# Altium project PLC.PrjPcb
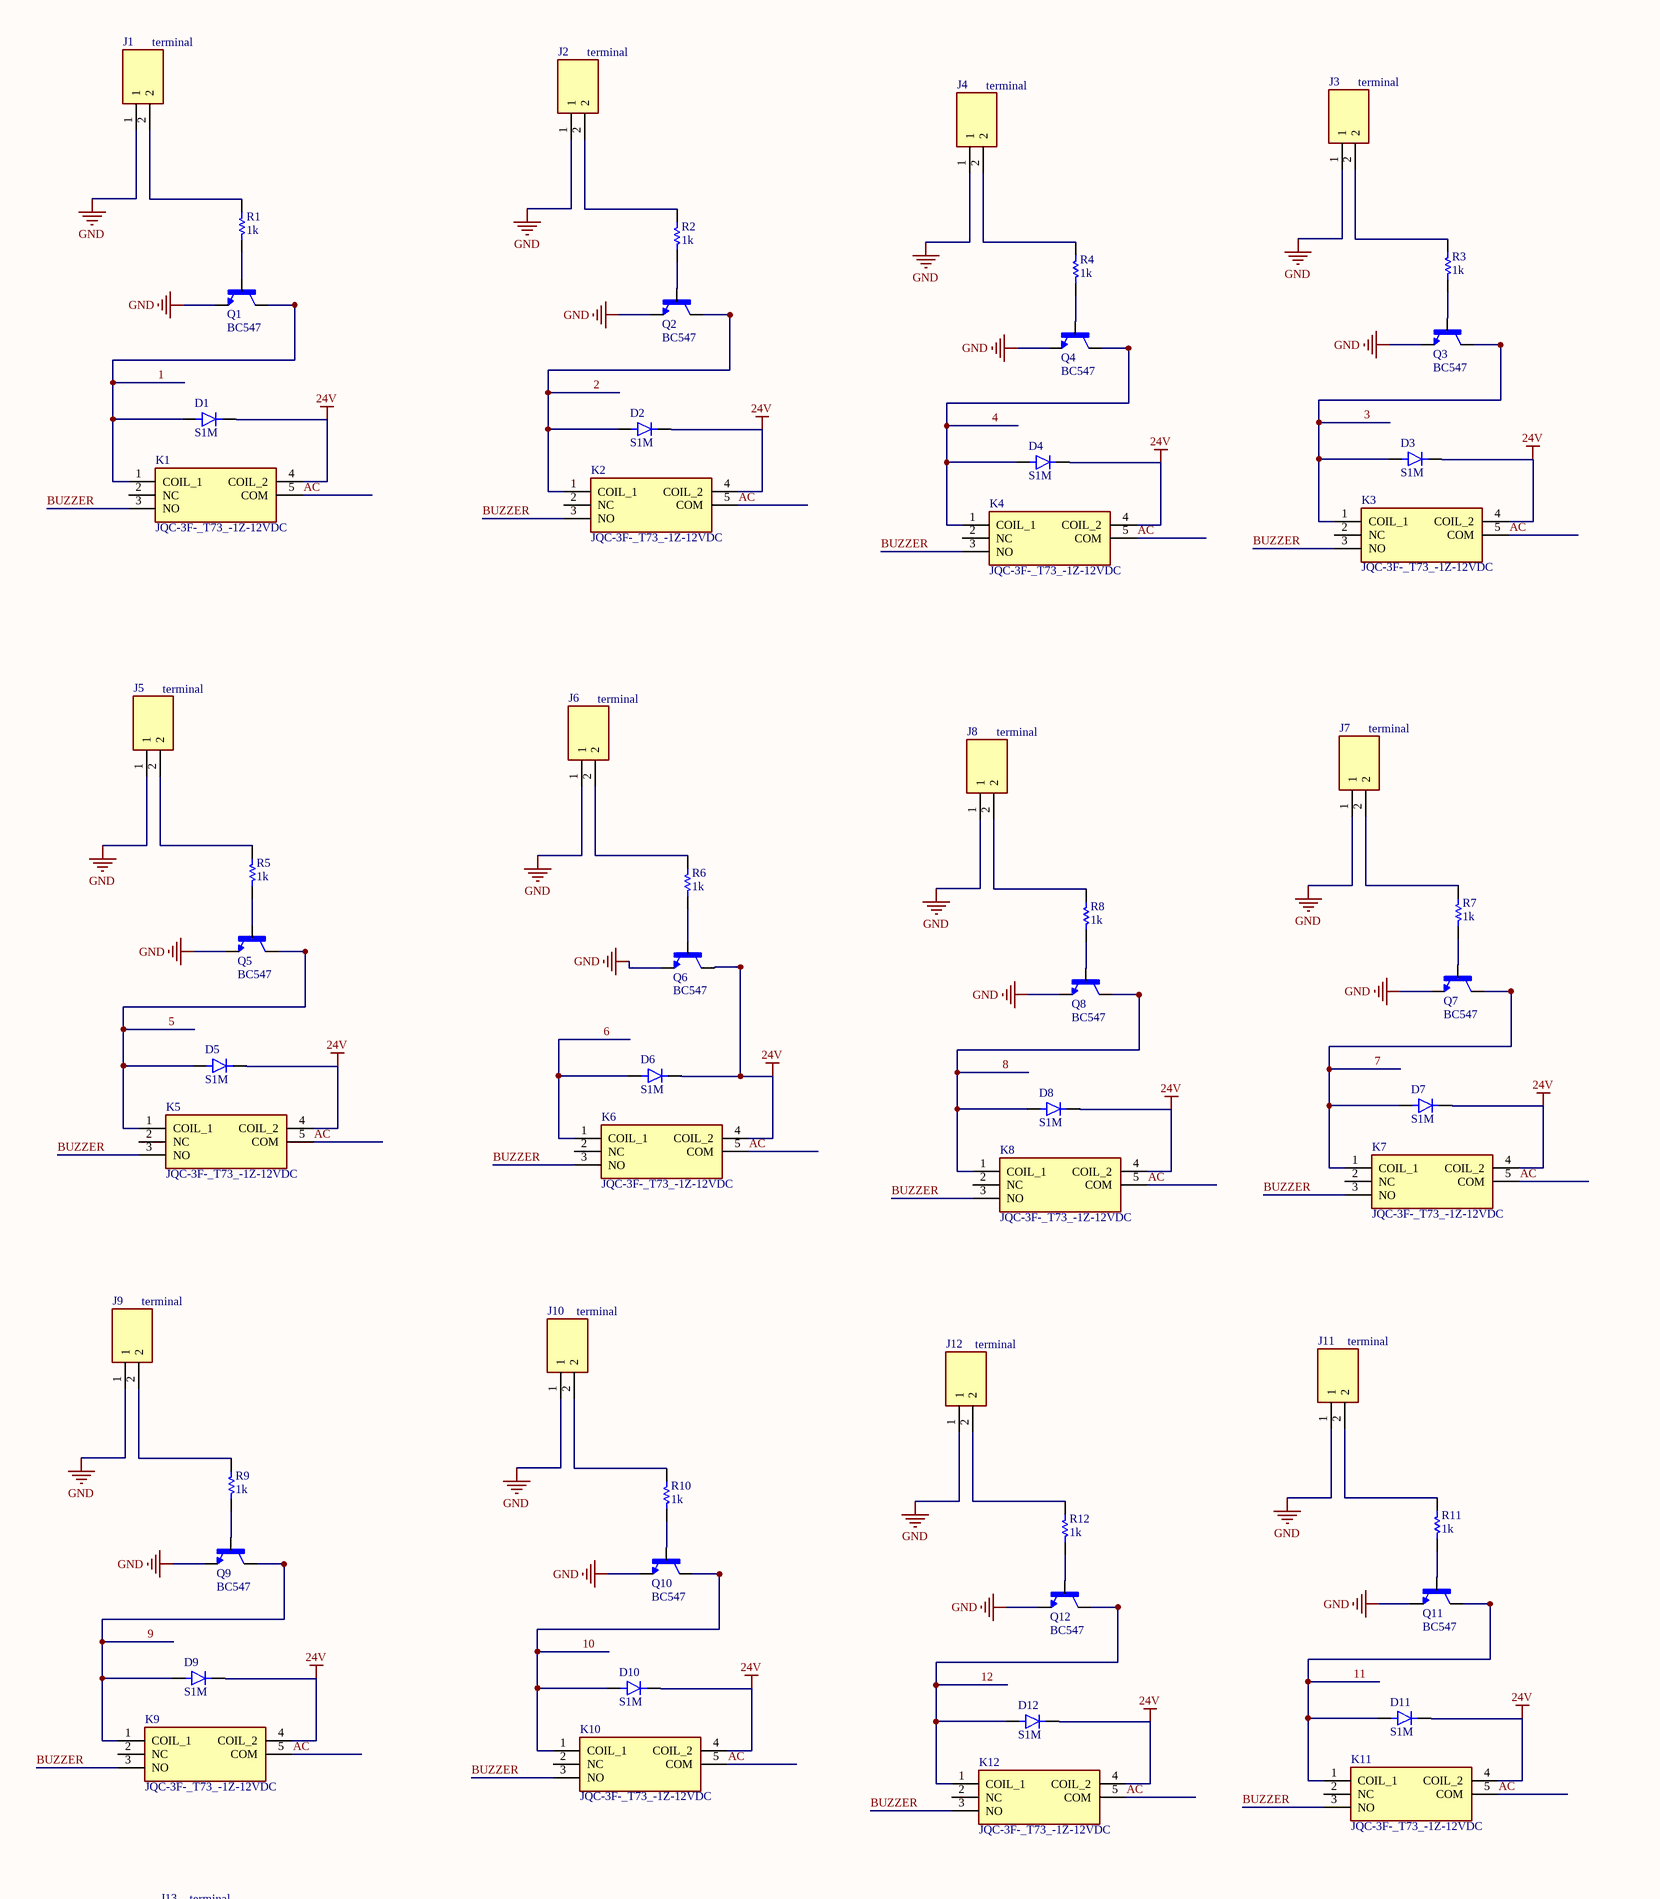
[diagram p0: Sheet1.SchDoc, top]
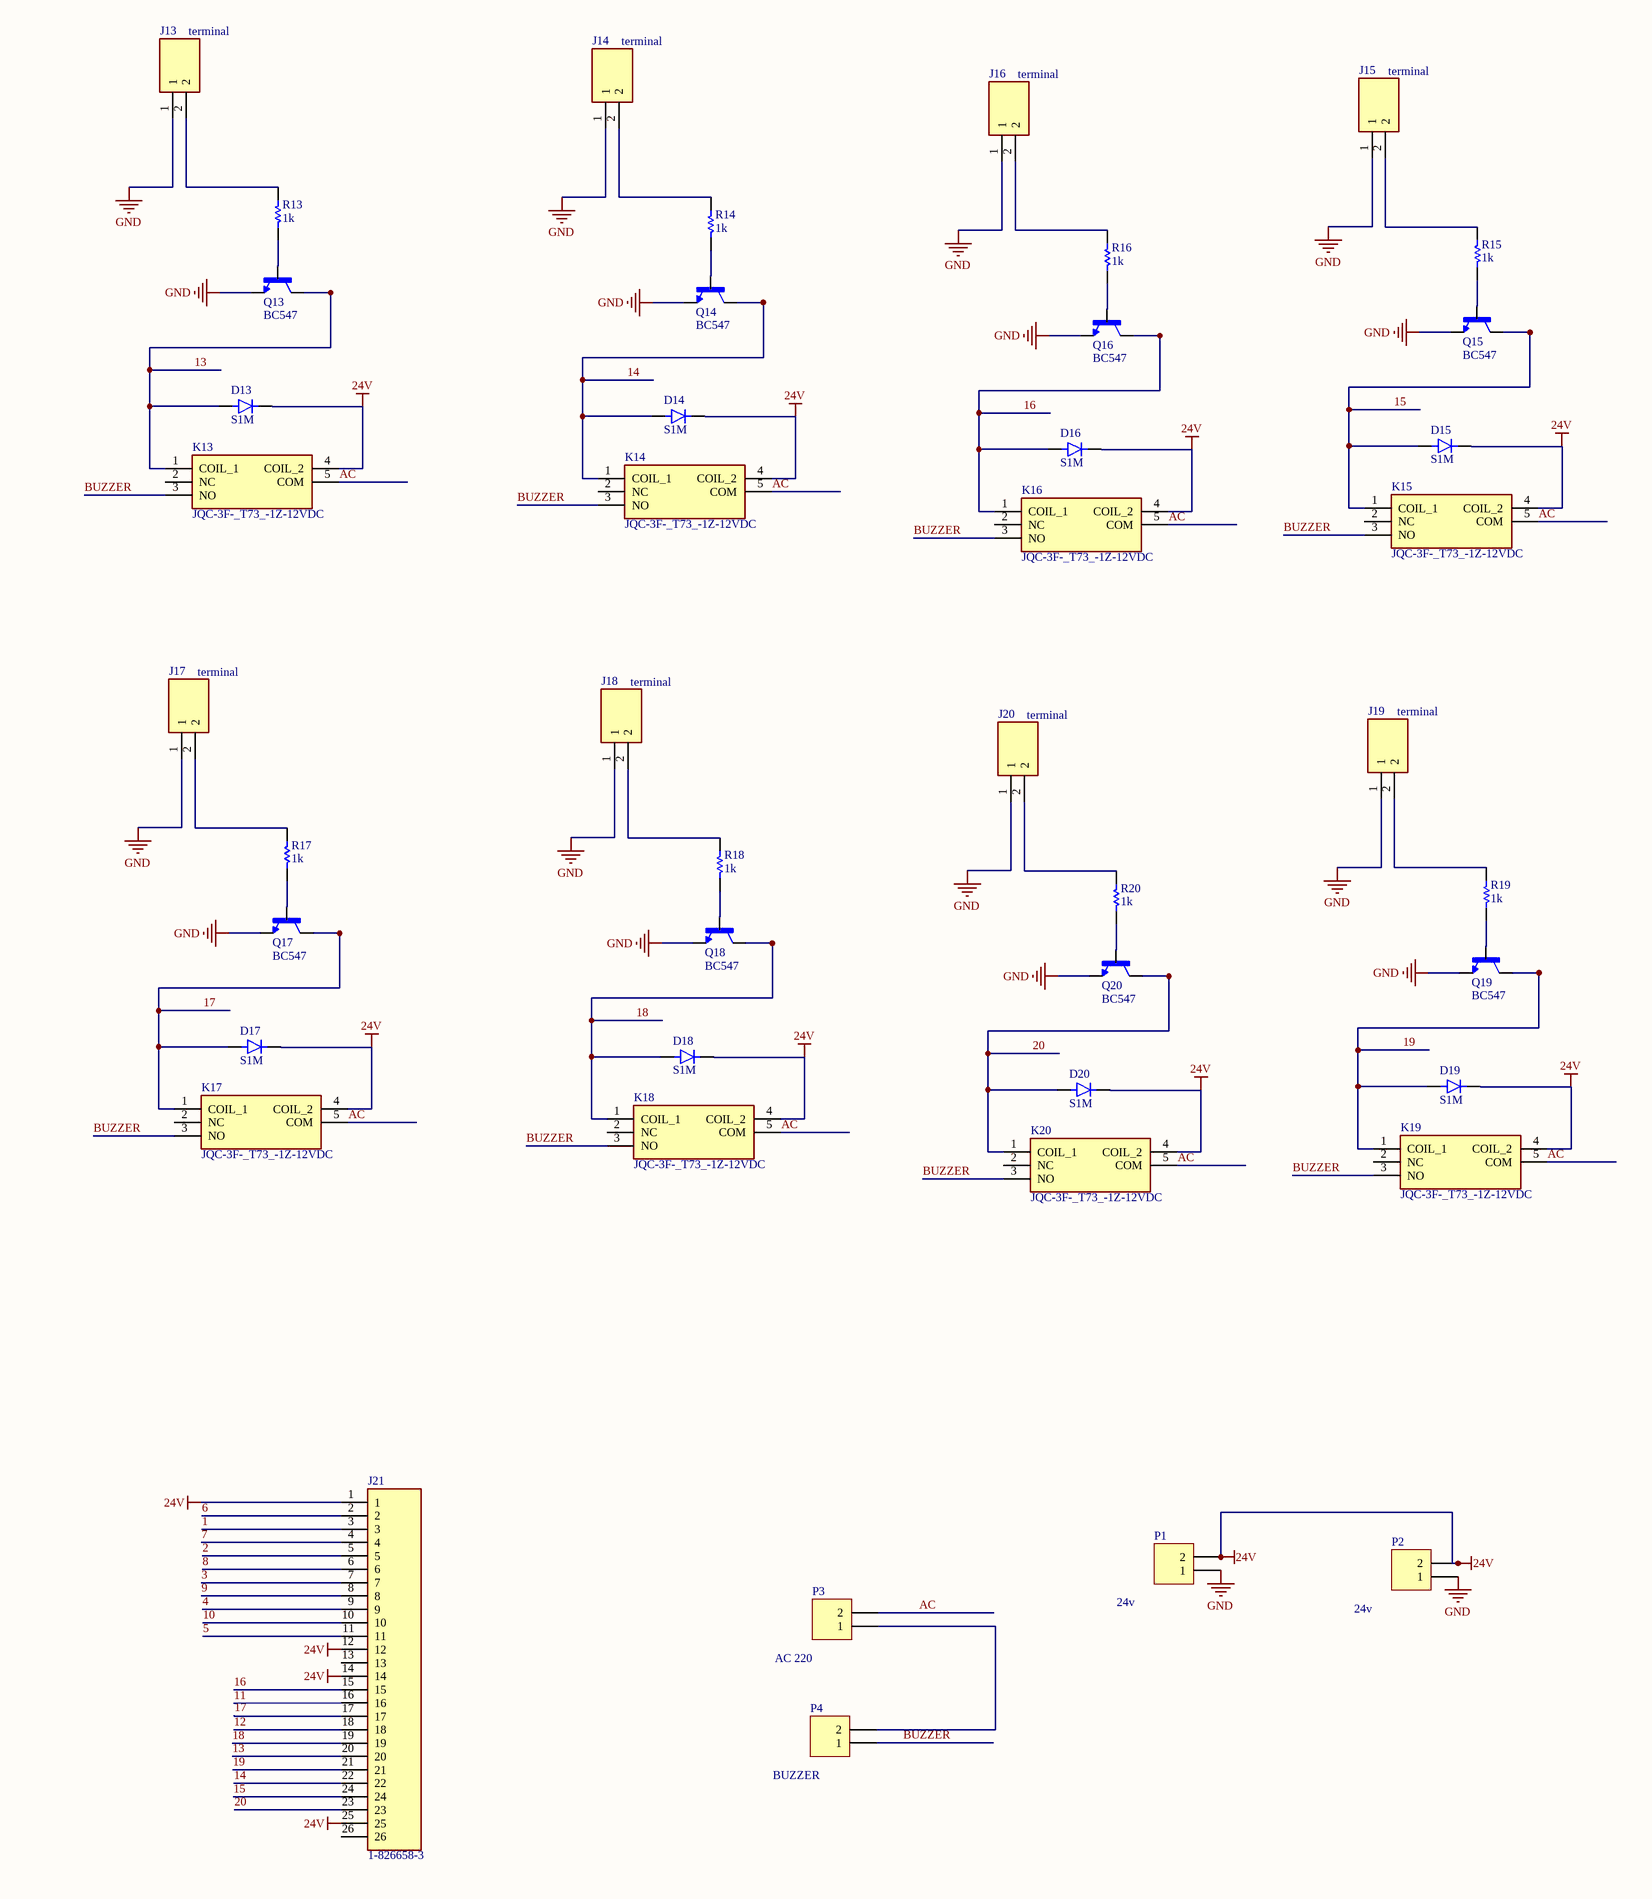
[diagram p1: Sheet1.SchDoc, bottom]
1 sheet, 105 parts. Net scope: global (net labels, ports and power ports of the same name join across sheets).
Board files: PCB1.PcbDoc, PCB2.PcbDoc

## Sheet Sheet1.SchDoc
size A0; SheetNumber: 1; SheetTotal: 2

### Parts
D1  S1M  [DIOM5227X270N]
D2  S1M  [DIOM5227X270N]
D3  S1M  [DIOM5227X270N]
D4  S1M  [DIOM5227X270N]
D5  S1M  [DIOM5227X270N]
D6  S1M  [DIOM5227X270N]
D7  S1M  [DIOM5227X270N]
D8  S1M  [DIOM5227X270N]
D9  S1M  [DIOM5227X270N]
D10  S1M  [DIOM5227X270N]
D11  S1M  [DIOM5227X270N]
D12  S1M  [DIOM5227X270N]
D13  S1M  [DIOM5227X270N]
D14  S1M  [DIOM5227X270N]
D15  S1M  [DIOM5227X270N]
D16  S1M  [DIOM5227X270N]
D17  S1M  [DIOM5227X270N]
D18  S1M  [DIOM5227X270N]
D19  S1M  [DIOM5227X270N]
D20  S1M  [DIOM5227X270N]
J1  terminal  [PHOENIX_1935161]
J2  terminal  [PHOENIX_1935161]
J3  terminal  [PHOENIX_1935161]
J4  terminal  [PHOENIX_1935161]
J5  terminal  [PHOENIX_1935161]
J6  terminal  [PHOENIX_1935161]
J7  terminal  [PHOENIX_1935161]
J8  terminal  [PHOENIX_1935161]
J9  terminal  [PHOENIX_1935161]
J10  terminal  [PHOENIX_1935161]
J11  terminal  [PHOENIX_1935161]
J12  terminal  [PHOENIX_1935161]
J13  terminal  [PHOENIX_1935161]
J14  terminal  [PHOENIX_1935161]
J15  terminal  [PHOENIX_1935161]
J16  terminal  [PHOENIX_1935161]
J17  terminal  [PHOENIX_1935161]
J18  terminal  [PHOENIX_1935161]
J19  terminal  [PHOENIX_1935161]
J20  terminal  [PHOENIX_1935161]
J21  1-826658-3  [TE_1-826658-3]
K1  JQC-3F-_T73_-1Z-12VDC  [JQC3FT731Z12VDC]
K2  JQC-3F-_T73_-1Z-12VDC  [JQC3FT731Z12VDC]
K3  JQC-3F-_T73_-1Z-12VDC  [JQC3FT731Z12VDC]
K4  JQC-3F-_T73_-1Z-12VDC  [JQC3FT731Z12VDC]
K5  JQC-3F-_T73_-1Z-12VDC  [JQC3FT731Z12VDC]
K6  JQC-3F-_T73_-1Z-12VDC  [JQC3FT731Z12VDC]
K7  JQC-3F-_T73_-1Z-12VDC  [JQC3FT731Z12VDC]
K8  JQC-3F-_T73_-1Z-12VDC  [JQC3FT731Z12VDC]
K9  JQC-3F-_T73_-1Z-12VDC  [JQC3FT731Z12VDC]
K10  JQC-3F-_T73_-1Z-12VDC  [JQC3FT731Z12VDC]
K11  JQC-3F-_T73_-1Z-12VDC  [JQC3FT731Z12VDC]
K12  JQC-3F-_T73_-1Z-12VDC  [JQC3FT731Z12VDC]
K13  JQC-3F-_T73_-1Z-12VDC  [JQC3FT731Z12VDC]
K14  JQC-3F-_T73_-1Z-12VDC  [JQC3FT731Z12VDC]
K15  JQC-3F-_T73_-1Z-12VDC  [JQC3FT731Z12VDC]
K16  JQC-3F-_T73_-1Z-12VDC  [JQC3FT731Z12VDC]
K17  JQC-3F-_T73_-1Z-12VDC  [JQC3FT731Z12VDC]
K18  JQC-3F-_T73_-1Z-12VDC  [JQC3FT731Z12VDC]
K19  JQC-3F-_T73_-1Z-12VDC  [JQC3FT731Z12VDC]
K20  JQC-3F-_T73_-1Z-12VDC  [JQC3FT731Z12VDC]
P1  24v  [HDR1X2_SMD - THD]
P2  24v  [HDR1X2_SMD - THD]
P3  AC 220  [HDR1X2_SMD - THD]
P4  BUZZER  [HDR1X2_SMD - THD]
Q1  BC547  [TO92]
Q2  BC547  [TO92]
Q3  BC547  [TO92]
Q4  BC547  [TO92]
Q5  BC547  [TO92]
Q6  BC547  [TO92]
Q7  BC547  [TO92]
Q8  BC547  [TO92]
Q9  BC547  [TO92]
Q10  BC547  [TO92]
Q11  BC547  [TO92]
Q12  BC547  [TO92]
Q13  BC547  [TO92]
Q14  BC547  [TO92]
Q15  BC547  [TO92]
Q16  BC547  [TO92]
Q17  BC547  [TO92]
Q18  BC547  [TO92]
Q19  BC547  [TO92]
Q20  BC547  [TO92]
R1  1k  [0805 - CAP - duplicate]
R2  1k  [0805 - CAP - duplicate]
R3  1k  [0805 - CAP - duplicate]
R4  1k  [0805 - CAP - duplicate]
R5  1k  [0805 - CAP - duplicate]
R6  1k  [0805 - CAP - duplicate]
R7  1k  [0805 - CAP - duplicate]
R8  1k  [0805 - CAP - duplicate]
R9  1k  [0805 - CAP - duplicate]
R10  1k  [0805 - CAP - duplicate]
R11  1k  [0805 - CAP - duplicate]
R12  1k  [0805 - CAP - duplicate]
R13  1k  [0805 - CAP - duplicate]
R14  1k  [0805 - CAP - duplicate]
R15  1k  [0805 - CAP - duplicate]
R16  1k  [0805 - CAP - duplicate]
R17  1k  [0805 - CAP - duplicate]
R18  1k  [0805 - CAP - duplicate]
R19  1k  [0805 - CAP - duplicate]
R20  1k  [0805 - CAP - duplicate]

### Nets
24V: D1.C(K) D2.C(K) D3.C(K) D4.C(K) D5.C(K) D6.C(K) D7.C(K) D8.C(K) D9.C(K) D10.C(K) D11.C(K) D12.C(K) D13.C(K) D14.C(K) D15.C(K) D16.C(K) D17.C(K) D18.C(K) D19.C(K) D20.C(K) J21.1 J21.12 J21.14 J21.25 K1.4(COIL_2) K2.4(COIL_2) K3.4(COIL_2) K4.4(COIL_2) K5.4(COIL_2) K6.4(COIL_2) K7.4(COIL_2) K8.4(COIL_2) K9.4(COIL_2) K10.4(COIL_2) K11.4(COIL_2) K12.4(COIL_2) K13.4(COIL_2) K14.4(COIL_2) K15.4(COIL_2) K16.4(COIL_2) K17.4(COIL_2) K18.4(COIL_2) K19.4(COIL_2) K20.4(COIL_2) P1.2 P2.2 Q6.1(C)
GND: J1.1 J2.1 J3.1 J4.1 J5.1 J6.1 J7.1 J8.1 J9.1 J10.1 J11.1 J12.1 J13.1 J14.1 J15.1 J16.1 J17.1 J18.1 J19.1 J20.1 P1.1 P2.1 Q1.3(E) Q2.3(E) Q3.3(E) Q4.3(E) Q5.3(E) Q6.3(E) Q7.3(E) Q8.3(E) Q9.3(E) Q10.3(E) Q11.3(E) Q12.3(E) Q13.3(E) Q14.3(E) Q15.3(E) Q16.3(E) Q17.3(E) Q18.3(E) Q19.3(E) Q20.3(E)
1: D1.A J21.3 K1.1(COIL_1) Q1.1(C)
2: D2.A J21.5 K2.1(COIL_1) Q2.1(C)
3: D3.A J21.7 K3.1(COIL_1) Q3.1(C)
4: D4.A J21.9 K4.1(COIL_1) Q4.1(C)
5: D5.A J21.11 K5.1(COIL_1) Q5.1(C)
6: D6.A J21.2 K6.1(COIL_1)
7: D7.A J21.4 K7.1(COIL_1) Q7.1(C)
8: D8.A J21.6 K8.1(COIL_1) Q8.1(C)
9: D9.A J21.8 K9.1(COIL_1) Q9.1(C)
10: D10.A J21.10 K10.1(COIL_1) Q10.1(C)
11: D11.A J21.16 K11.1(COIL_1) Q11.1(C)
12: D12.A J21.18 K12.1(COIL_1) Q12.1(C)
13: D13.A J21.20 K13.1(COIL_1) Q13.1(C)
14: D14.A J21.22 K14.1(COIL_1) Q14.1(C)
15: D15.A J21.24 K15.1(COIL_1) Q15.1(C)
16: D16.A J21.15 K16.1(COIL_1) Q16.1(C)
17: D17.A J21.17 K17.1(COIL_1) Q17.1(C)
18: D18.A J21.19 K18.1(COIL_1) Q18.1(C)
19: D19.A J21.21 K19.1(COIL_1) Q19.1(C)
20: D20.A J21.23 K20.1(COIL_1) Q20.1(C)
AC: K1.5(COM) K2.5(COM) K3.5(COM) K4.5(COM) K5.5(COM) K6.5(COM) K7.5(COM) K8.5(COM) K9.5(COM) K10.5(COM) K11.5(COM) K12.5(COM) K13.5(COM) K14.5(COM) K15.5(COM) K16.5(COM) K17.5(COM) K18.5(COM) K19.5(COM) K20.5(COM) P3.2
BUZZER: K1.3(NO) K2.3(NO) K3.3(NO) K4.3(NO) K5.3(NO) K6.3(NO) K7.3(NO) K8.3(NO) K9.3(NO) K10.3(NO) K11.3(NO) K12.3(NO) K13.3(NO) K14.3(NO) K15.3(NO) K16.3(NO) K17.3(NO) K18.3(NO) K19.3(NO) K20.3(NO) P4.1
NetJ1_2: J1.2 R1.2
NetJ2_2: J2.2 R2.2
NetJ3_2: J3.2 R3.2
NetJ4_2: J4.2 R4.2
NetJ5_2: J5.2 R5.2
NetJ6_2: J6.2 R6.2
NetJ7_2: J7.2 R7.2
NetJ8_2: J8.2 R8.2
NetJ9_2: J9.2 R9.2
NetJ10_2: J10.2 R10.2
NetJ11_2: J11.2 R11.2
NetJ12_2: J12.2 R12.2
NetJ13_2: J13.2 R13.2
NetJ14_2: J14.2 R14.2
NetJ15_2: J15.2 R15.2
NetJ16_2: J16.2 R16.2
NetJ17_2: J17.2 R17.2
NetJ18_2: J18.2 R18.2
NetJ19_2: J19.2 R19.2
NetJ20_2: J20.2 R20.2
NetP3_1: P3.1 P4.2
NetQ1_2: Q1.2(B) R1.1
NetQ2_2: Q2.2(B) R2.1
NetQ3_2: Q3.2(B) R3.1
NetQ4_2: Q4.2(B) R4.1
NetQ5_2: Q5.2(B) R5.1
NetQ6_2: Q6.2(B) R6.1
NetQ7_2: Q7.2(B) R7.1
NetQ8_2: Q8.2(B) R8.1
NetQ9_2: Q9.2(B) R9.1
NetQ10_2: Q10.2(B) R10.1
NetQ11_2: Q11.2(B) R11.1
NetQ12_2: Q12.2(B) R12.1
NetQ13_2: Q13.2(B) R13.1
NetQ14_2: Q14.2(B) R14.1
NetQ15_2: Q15.2(B) R15.1
NetQ16_2: Q16.2(B) R16.1
NetQ17_2: Q17.2(B) R17.1
NetQ18_2: Q18.2(B) R18.1
NetQ19_2: Q19.2(B) R19.1
NetQ20_2: Q20.2(B) R20.1

Not connected (* = marked no-connect by the designer): J21 13 26; K1 2(NC); K2 2(NC); K3 2(NC); K4 2(NC); K5 2(NC); K6 2(NC); K7 2(NC); K8 2(NC); K9 2(NC); K10 2(NC); K11 2(NC); K12 2(NC); K13 2(NC); K14 2(NC); K15 2(NC); K16 2(NC); K17 2(NC); K18 2(NC); K19 2(NC); K20 2(NC)

### Library data of the parts
D1-D20 = S1M: Diode Standard 1000 V 1A Surface Mount DO-214AC (SMA); MF: Diotec Semiconductor; Value: *; MP: S1M; Price: None; Package: DO-214AC-2 Diotec; Availability: In Stock; SnapEDA_Link: https://www.snapeda.com/parts/S1M/Diotec/view-part/?ref=snap; Purchase-URL: https://pricing.snapeda.com/search/part/S1M/?ref=eda; Check_prices: https://www.snapeda.com/parts/S1M/Diotec/view-part/?ref=eda
J1-J20 = TB008A-508-02BE: Fixed Terminal Blocks screw type, 5.08 , 45 , 2 poles, CUI Blue, slotted screw, PCB mount; Manufacturer_Name: CUI Devices; Geometry.Height: 15.82mm; Manufacturer_Part_Number: TB008A-508-02BE; Mouser Part Number: 490-TB008A-508-02BE; Mouser Price/Stock: https://www.mouser.co.uk/ProductDetail/CUI-Devices/TB008A-508-02BE?qs=vLWxofP3U2w5I2Hxj8y2hQ%3D%3D; Arrow Part Number: TB008A-508-02BE; Arrow Price/Stock: https://www.arrow.com/en/products/tb008a-508-02be/cui-devices?region=nac; Datasheet Link: https://componentsearchengine.com/Datasheets/1/TB008A-508-02BE.pdf
J21 = 1-826658-3: AMPMODU II PIN HEADER 2X13P; Product_Type: Connector; Centerline_Pitch: 2.54 mm[.1 in]; Number_of_Positions: 26; MF: TE Connectivity; MP: 1-826658-3; Package: None; EU_RoHS_Compliance: Compliant; Check_prices: https://www.snapeda.com/parts/1-826658-3/TE%20Connectivity%20AMP%20Connectors/view-part/1429931/?ref=eda; SnapEDA_Link: https://www.snapeda.com/parts/1-826658-3/TE%20Connectivity%20AMP%20Connectors/view-part/1429931/?ref=snap; Price: None; Availability: Warning; Value: *
K1-K20 = JQC-3F-_T73_-1Z-12VDC: RELAY POWER 10A 12VDC 1C PCB TYPE (JS1) 5PIN QIANJ; Manufacturer_Name: QIANJI; Manufacturer_Part_Number: JQC-3F-(T73)-1Z-12VDC; Geometry.Height: 15.5mm; Mouser Part Number: *; Mouser Price/Stock: *; Arrow Part Number: *; Arrow Price/Stock: *; Datasheet Link: https://img.ozdisan.com/ETicaret_Dosya/341245_8627675.pdf
P1-P4 = Header 2: Header, 2-Pin; LatestRevisionDate: 17-Jul-2002; LatestRevisionNote: Re-released for DXP Platform.; Publisher: Altium Limited
Q1-Q20 = BC547: Trans GP BJT NPN 45V 0.1A 500mW 3-Pin TO-92 T/R; MF: ON Semiconductor; Package: None; Price: None; Value: *; SnapEDA_Link: https://www.snapeda.com/parts/BC547/Onsemi/view-part/?ref=snap; MP: BC547; Availability: In Stock; Check_prices: https://www.snapeda.com/parts/BC547/Onsemi/view-part/?ref=eda
R1-R20 = Res1: Resistor; Value: 10k; Published: 8-Jun-2000; LatestRevisionDate: 17-Jul-2002; LatestRevisionNote: Re-released for DXP Platform.; PackageReference: AXIAL-0.3; Publisher: Altium Limited; PackageDescription: Axial Device, Thru-Hole; 2 Leads; 0.3 in Pin Spacing